# EAGLE design HallE (EAGLE 9.3.0)
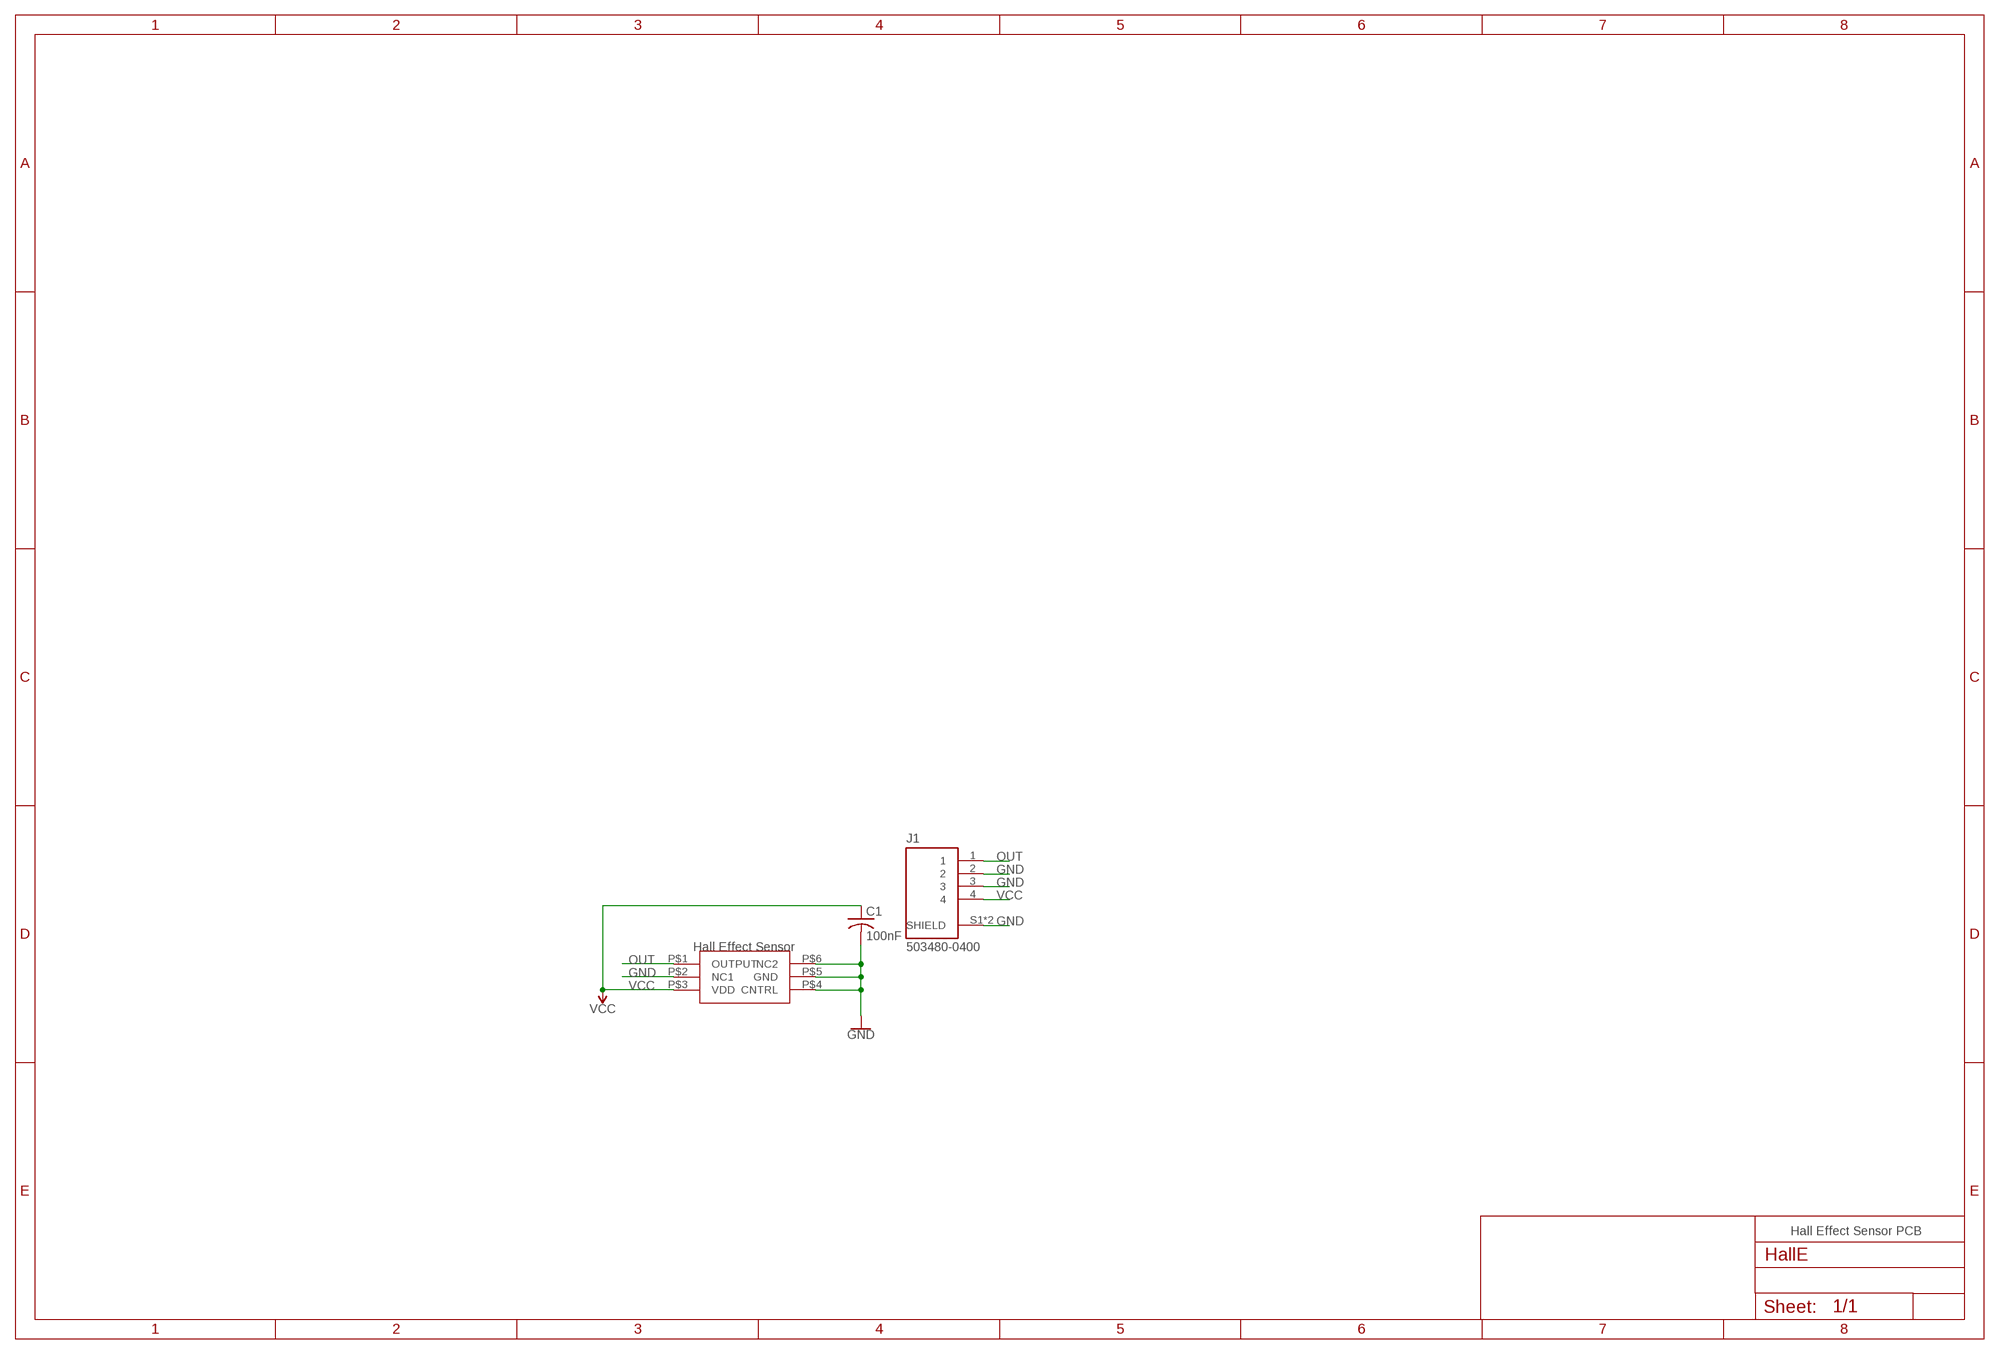
[diagram p0: schematic, sheet 1]

## Parts
C1  100nF  C-USC0805  [C0805]
J1  503480-0400  [MOLEX_503480-0400]
U$1  AH8503  [UDFN-6]

## Nets
GND: C1.2 J1.2 J1.3 J1.S1(SHIELD) J1.S2(SHIELD) U$1.P$2(NC1) U$1.P$4(CNTRL) U$1.P$5(GND) U$1.P$6(NC2)
OUT: J1.1 U$1.P$1(OUTPUT)
VCC: C1.1 J1.4 U$1.P$3(VDD)

## Notes on the sheet
- Hall Effect Sensor
- Hall Effect Sensor PCB

## Library data of the parts
C1 = adafruit:C-US: CAPACITOR, American symbol
J1 = 503480-0400:503480-0400: 0.50mm Pitch Easy-On™ BackFlip™ Type FPC Connector, 1.00mm Height, Right Angle, SMT, Dual Contact Style, 4 Circuits; DESCRIPTION: 4 Position FFC, FPC Connector Contacts, Top and Bottom 0.020 _0.50mm_ Surface Mount, Right Angle; DIGI-KEY_PART_NUMBER: WM1386CT-ND; DIGI-KEY_PURCHASE_URL: https://www.digikey.com/product-detail/en/molex/5034800400/WM1386CT-ND/2356640?utm_source=snapeda&utm_medium=aggregator&utm_campaign=symbol; MF: Molex; MP: 5034800400; PACKAGE: None
U$1 = UDFN-6:AH8503

## Board
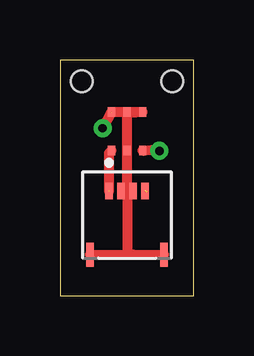
[diagram p1: board, top side]
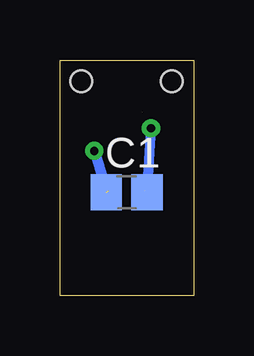
[diagram p2: board, bottom side, seen from below]

Size 5.57 x 9.83 mm. Coordinates in mm from the lower left corner, seen from the top.
Outline: 0,0 5.57,0 5.57,9.83 0,9.83 0,0
Copper layers (1*16): Top 0.035mm / dielectric 1.5mm / Bottom 0.035mm
Design rules "default": minimum track width 6mil, minimum drill 0.35mm, track to track 6mil, track to pad 6mil, pad to pad 6mil, via to via 6mil, smd to smd 6mil, copper to edge 40mil, drill to drill 6mil, minimum pad ring 10mil, minimum via ring 8mil, stop-mask expansion 4mil, vias tented up to drill 0mil, thermal gap 10mil
Holes 0.9 mm at 0.91,8.94 4.67,8.94

### Footprints (pad centres in the part's own frame; a part is rotated, then mirrored left to right if it is on the bottom)
C0805 = smd 1.3 x 1.5: 1 -0.85,0; 2 0.85,0
MOLEX_503480-0400 = smd 0.3 x 0.7: 1 -0.75,1.325; 2 -0.25,1.325; 3 0.25,1.325; 4 0.75,1.325 | smd 0.3 x 1: S1 -1.54,-1.325; S2 1.54,-1.325
UDFN-6 = smd 0.3 x 0.4: P$1 -0.65,-0.8; P$2 0,-0.8; P$3 0.65,-0.8; P$4 0.65,0.8; P$5 0,0.8; P$6 -0.65,0.8

### Placement (x,y rotation side)
C1  2.79,4.32 0 bottom
J1  2.79,3.05 0 top
U$1  2.79,6.86 0 top

### Tracks (layer width: path | path; a pad name or v marks a point on that pad's centre or on a via)
GND  (via drill 0.35)  (1 unrouted)
  Top 0.254: J1.2 2.79,4.37 J1.3
  Top 0.406: J1.S1 2.79,1.72 | 2.79,1.72 3.05,1.72 | 3.05,1.72 J1.S2 | 3.04,1.73 3.05,1.72 | U$1.P$5 U$1.P$2 2.79,4.37 2.79,1.72 | U$1.P$5 U$1.P$6 v1.78,6.99 | U$1.P$5 3.19,7.66 | U$1.P$4 U$1.P$5
  Bottom 0.406: v1.78,6.99 C1.2
OUT  (1 unrouted)
  Top 0.406: U$1.P$1 2.04,5.95 J1.1
VCC  (via drill 0.35)  (1 unrouted)
  Top 0.406: v4.14,6.04 4.09,6.09 3.52,6.06 U$1.P$3
  Bottom 0.406: v4.14,6.04 3.64,4.43 C1.1